# EasyEDA Pro project ProPrj_由机芯智能技术人员指导下的新合成板_20250317_2025-03-25.epro

# Schematic stm32桌面宠物
Board Name: stm32桌面宠物; Create Date: 2025-03-22; Page Name: P1; Project Name: 最新桌面宠物控制板-V1.2_20250317; Schematic Name: stm32桌面宠物; Update Date: 2025-03-22; Company: 嘉立创EDA; Page Size: A4; Version: V1.0
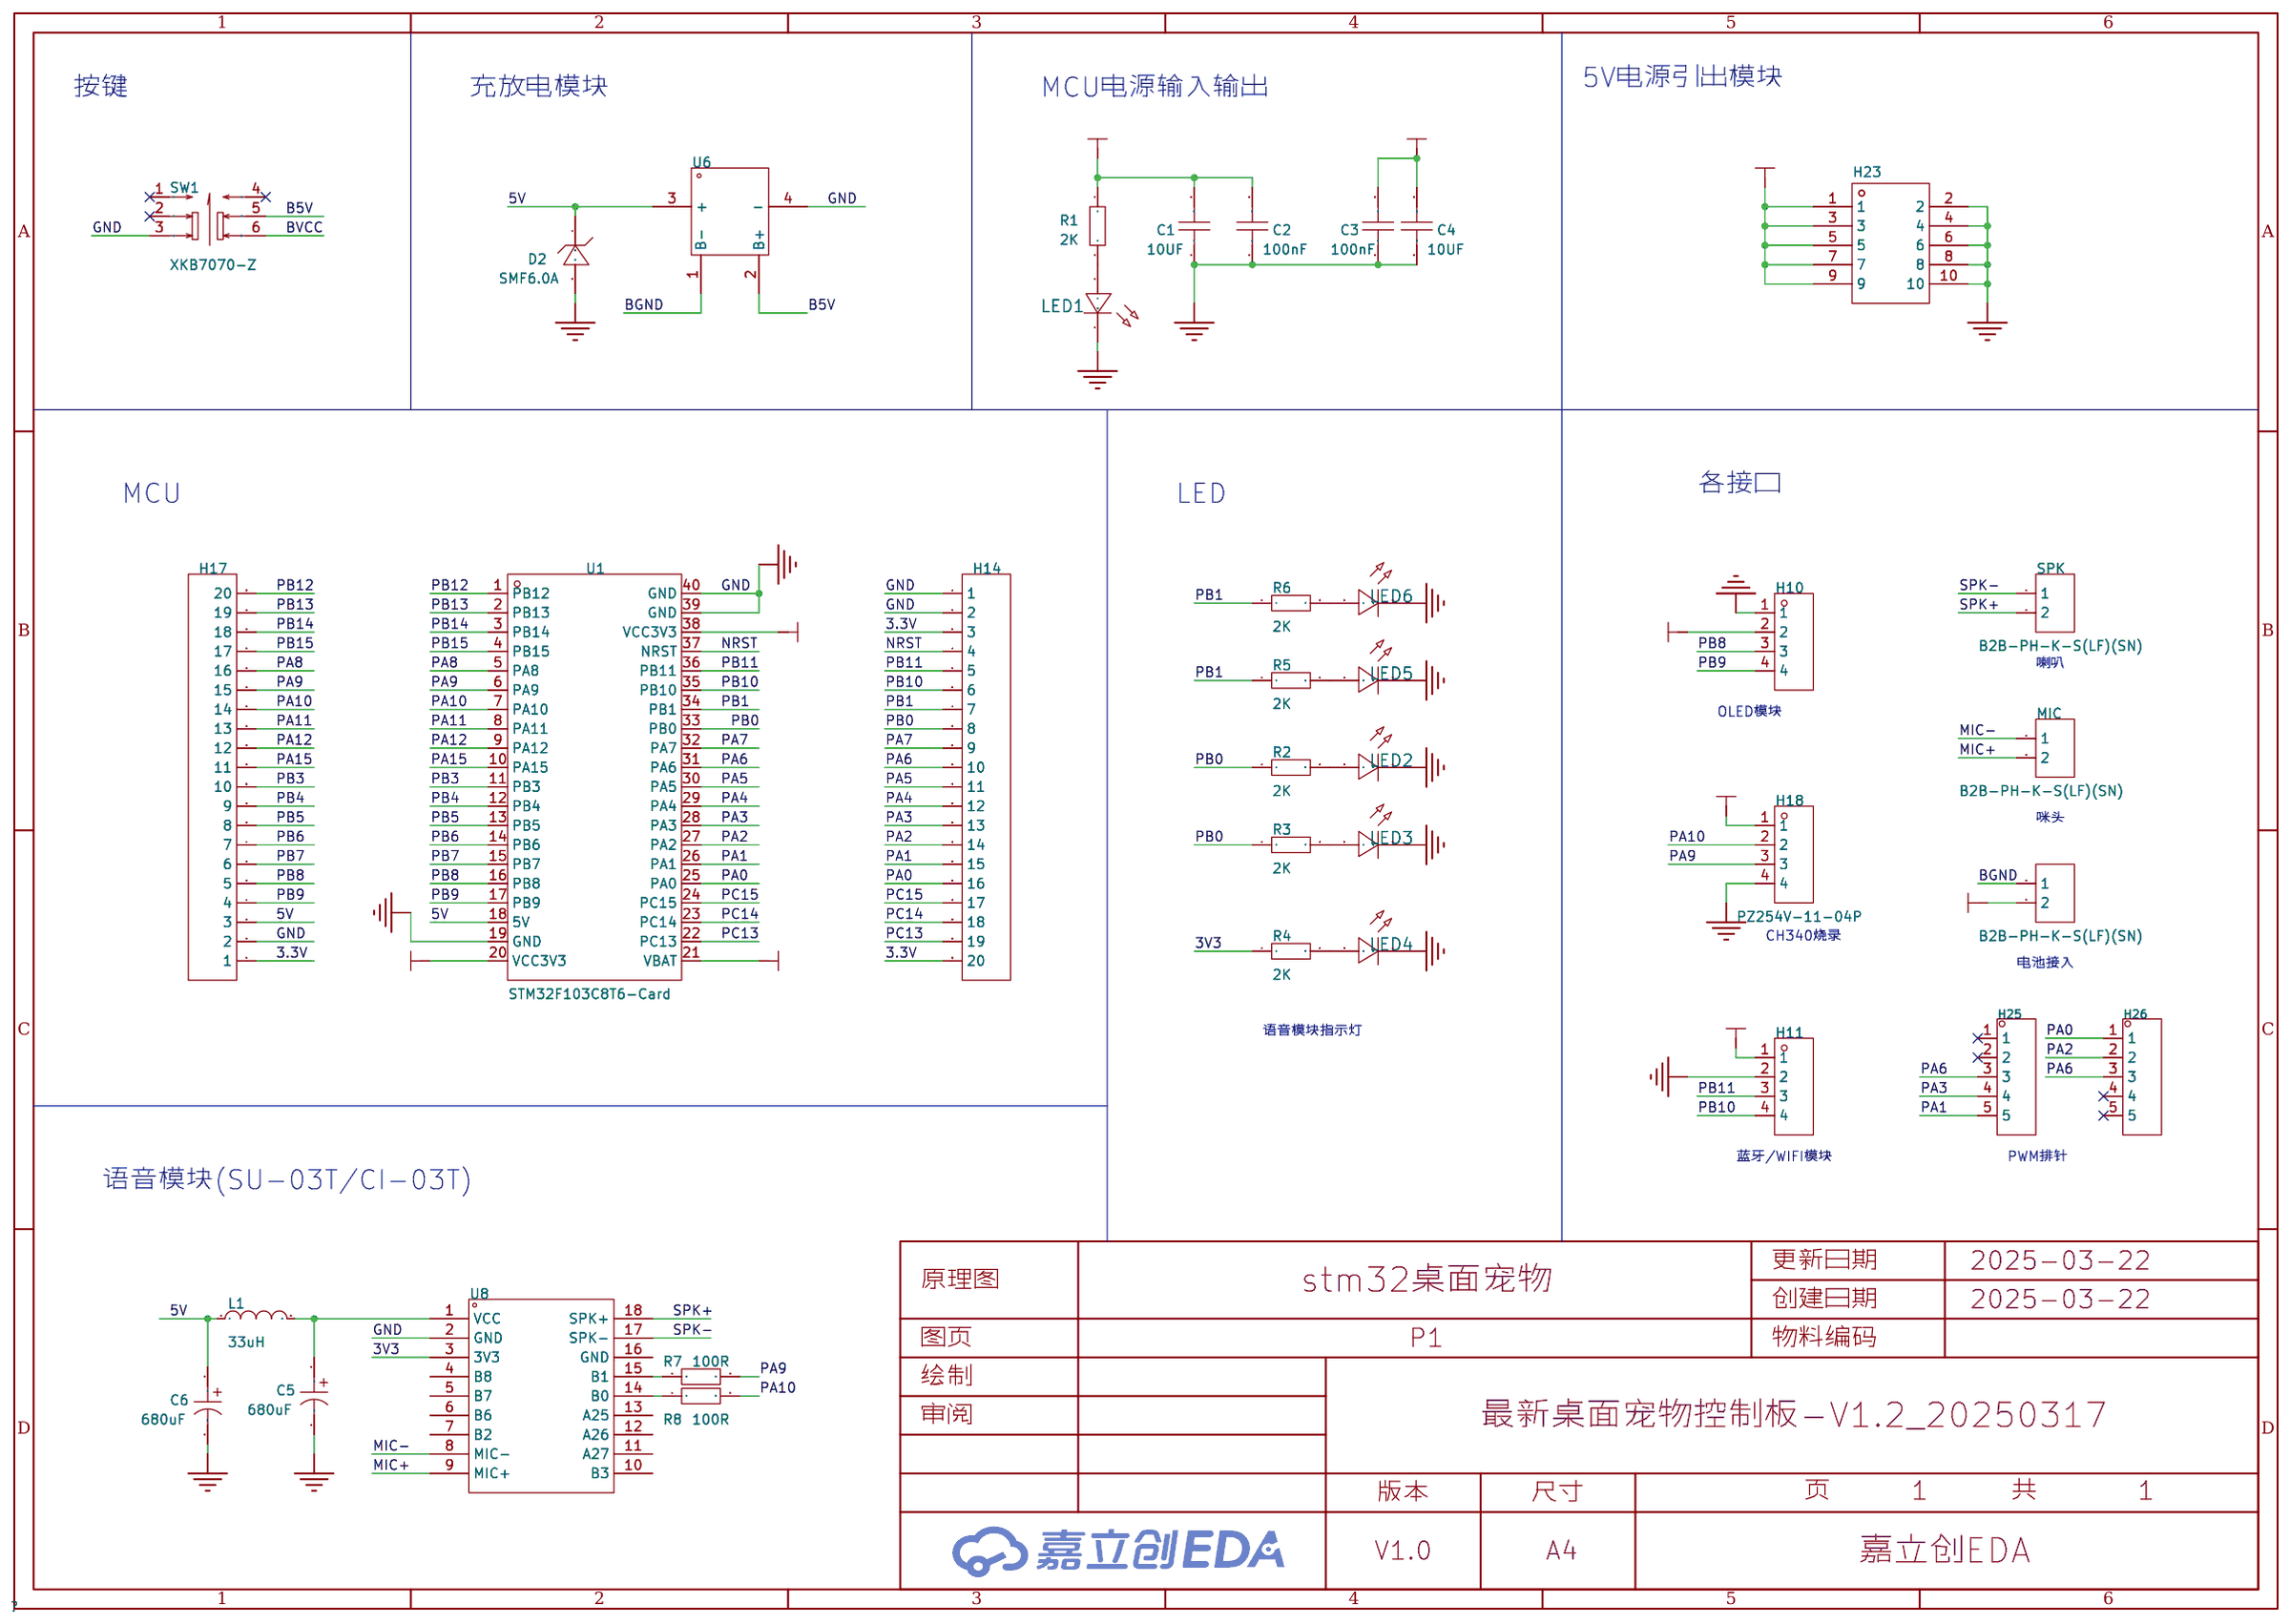
[diagram p0: schematic sheet]

## Parts
C1  10UF  [C0805]
C2  100nF  [C0805]
C3  100nF  [C0805]
C4  10UF  [C0805]
C5  680uF  [CAP-TH_BD8.0-P3.50-D0.6-FD_1]
C6  680uF  [CAP-TH_BD8.0-P3.50-D0.6-FD_1]
D2  SMF6.0A  [SOD-123FL_L2.8-W1.8-LS3.8-RD]
H10  -  [HDR-TH_4P-P2.54-V-F]
H11  -  [HDR-TH_4P-P2.54-V-F]
H14  -  [HDR-TH_20P-P2.54-V-F]
H17  -  [HDR-TH_20P-P2.54-V-F]
H18  PZ254V-11-04P  [HDR-TH_4P-P2.54-V-M]
H23  -  [HDR-TH_10P-P2.54-V-M-R2-C5-S2.54]
H25  -  [HDR-TH_5P-P2.54-V-M]
H26  -  [HDR-TH_5P-P2.54-V-M]
L1  33uH  [IND-TH_BD7.5-P3.00-D0.6]
LED1  -  [LED_0805]
LED2  -  [LED_0805]
LED3  -  [LED_0805]
LED4  -  [LED_0805]
LED5  -  [LED_0805]
LED6  -  [LED_0805]
MIC  B2B-PH-K-S(LF)(SN)  [CONN-TH_B2B-PH-K-S]
R1  2K  [R0805]
R2  2K  [R0805]
R3  2K  [R0805]
R4  2K  [R0805]
R5  2K  [R0805]
R6  2K  [R0805]
R7  100R  [R0805]
R8  100R  [R0805]
SPK  B2B-PH-K-S(LF)(SN)  [CONN-TH_B2B-PH-K-S]
SW1  XKB7070-Z  [SW-TH_6P-L7.0-W7.0-P2.00]
U1  STM32F103C8T6-Card  [CONN-TH_L53.3-W22.9_STM32F103C8T6-CARD]
U6  -  [充放电模块更新]
U8  -  [SU-03T带排针]
接锂电池  B2B-PH-K-S(LF)(SN)  [CONN-TH_B2B-PH-K-S]

## Library data of the parts
C1-C4 = CAP_0805: Supplier Footprint: 0805
C5 C6 = CD2884771EM0812VFL: 容值:470uF;额定电压:25V;; LCSC Part Name: 470uF 25V; Supplier Part: C2960233; Manufacturer: HRK(鸿瑞凯电子); Supplier Footprint: 插件,D8xL12mm; Datasheet: https://atta.szlcsc.com/upload/public/pdf/source/20240703/D49961C1CEC6E325964F7113D69E9087.pdf; Supplier: LCSC; Rated Voltage: 25V; φD: 8mm; L: 12mm; Operating Temperature: -40℃~+105℃
D2 = SMF6.0A: 极性:单向;反向截止电压(Vrwm):6V;钳位电压:10.3V;峰值脉冲电流(Ipp):19.4A;峰值脉冲功率(Ppp):200W;击穿电压:6.67V;; LCSC Part Name: 单向TVS 6V截止 19.4A峰值脉冲; Supplier Part: C2980406; Manufacturer: GOODWORK(固得沃克); Supplier Footprint: SOD-123FL; Datasheet: https://atta.szlcsc.com/upload/public/pdf/source/20240508/80D6E9463317C72355489DDC2072889A.pdf; Supplier: LCSC; Polarity: 单向; Reverse Stand-Off Voltage (Vrwm): 6V; Clamping Voltage: 10.3V; Peak Pulse Current (Ipp): 19.4A; Peak Pulse Power Dissipation (Ppp): 200W; Voltage - Breakdown: 6.67V; Reverse Leakage Current (Ir): 400uA; Number of Channels: 单路; Operating Temperature: -55℃~+150℃@(Tj); Type: TVS
H10 H11 = HDR-F_2.54_1x4P: Supplier Part: C2718488; Supplier Footprint: 插件
H14 H17 = HDR-F_2.54_1x20P: Supplier Part: C50984; Supplier Footprint: 插件
H18 = PZ254V-11-04P: 插针结构:1x4P;间距:2.54mm;行距:-;圆针/方针:方针;安装类型:直插;排数:单排;总PIN位数:4P;额定电流:3A;额定电压:250V;配合针长度:6mm;塑高:2.5mm;端接针长度:3mm;触头材质:-;工作温度范围:-40℃~+105℃;颜色:黑色;; LCSC Part Name: 间距:2.54mm 1x4P 直插 方针; Supplier Part: C2691448; Manufacturer: XFCN(兴飞); Supplier Footprint: 插件,P=2.54mm; JLCPCB Part Class: Extended Part; Datasheet: https://atta.szlcsc.com/upload/public/pdf/source/20200309/C492403_F9F19131791D08044AD4F84F8E751A34.pdf; Supplier: LCSC; Pin Structure: 1x4P; Pitch: 2.54mm; Circluar Pins/Square Pins: 方针; Mounting Type: 直插; Number of Rows: 单排; Number of Pins: 4P; Current Rating (Max): 3A; Voltage Rating (Max): 250V; Length of Mating Pin: 6mm; Insulation Height: 2.5mm; Length of End Connection Pin: 3mm; Operating Temperature Range: -40℃~+105℃; Color: 黑色
H23 = HDR-M_2.54_2x5: Supplier Part: C124387; Supplier Footprint: 插件,P=2.54mm
H25 H26 = HDR-M_2.54_1x5P: Supplier Part: C358687; Supplier Footprint: 插件
L1 = XR6*10-330K-S: 电感值:33uH;精度:±10%;饱和电流(Isat):1A;类型:磁环电感;; LCSC Part Name: 33uH ±10% 1A 磁环电感; Supplier Part: C22447637; Manufacturer: XR(祥如); Supplier Footprint: 插件,D7.5xL13mm; Datasheet: https://atta.szlcsc.com/upload/public/pdf/source/20240529/30D566BBC3D03FE80C0AAAF1CFF56DF1.pdf; Supplier: LCSC; Tolerance: ±10%; Current - Saturation (Isat): 1A; DC Resistance: 250mΩ; Type: 磁环电感; Wire Diameter: 0.3mm
LED1-LED6 = LED_0805-R: Supplier Footprint: 0805
MIC SPK 接锂电池 = B2B-PH-K-S(LF)(SN): 插针结构:1x2P;间距:2mm;安装方式:直插;参考系列:PH;总PIN数:2P;排数:1;每排PIN数:2;行距:-;额定电流:2A;触头材质:黄铜;触头镀层:锡;工作温度范围:-25℃~+85℃;; LCSC Part Name: 1x2P 间距:2mm 直插 系列:PH; Supplier Part: C131337; Manufacturer: JST; Supplier Footprint: 插件,P=2mm; JLCPCB Part Class: Extended Part; Datasheet: https://atta.szlcsc.com/upload/public/pdf/source/20171026/C131342_15089839687311058815.pdf; Supplier: LCSC; Pins Structure: 1x2P; Pitch: 2mm; Mounting Style: 直插; Reference Series: PH; Number of Pins: 2P; Number of Rows: 1; Number of PINs Per Row: 2; Current Rating (Max): 2A; Contact Material: 黄铜; Contact Plating: 锡; Operating Temperature Range: -25℃~+85℃; Rated Voltage (Max): 100V; Plastic Material: PA66; Flame Retardant Rating: UL94V-0; Supplementary Features: 打K脚; Colour: 白色; Z-Height of the Board: 6mm; X-Length of Bottom Edge on Board (Spacing Line): 5.9mm; Y-Width of Bottom Edge on Board: 4.5mm
R1-R8 = Res_0805: Supplier Footprint: 0805
SW1 = XKB7070-Z: 自锁/无锁:自锁;安装方式:直插;触点电流:100mA;额定电压 (AC):250V;额定电压 (DC):30V;带灯:不带;作用力:160gf;机械寿命:10万次;; LCSC Part Name: 按键开关   7*7插件自锁 蓝白黑; Supplier Part: C318863; Manufacturer: XKB Connectivity(中国星坤); Supplier Footprint: 插件; JLCPCB Part Class: 扩展库; Datasheet: https://atta.szlcsc.com/upload/public/pdf/source/20211015/75A682A27A424BDE8D93C2CFA14C38FE.pdf; Supplier: LCSC; Self Lock / No Lock: 自锁; Actuator Style: 矩形按钮; Mounting Style: 直插; Contact Current: 100mA; Voltage Rating (AC): 250V; Voltage Rating (DC): 30V; Insulation Resistance: 100MΩ; Actuator/Cap Color: 蓝色; With Lamp: 不带; Pin Style: PC引脚; Operating Force: 160gf; Operating Temperature: -15℃~+55℃; Mechanical Life: 10万次
U1 = STM32F103C8T6-Card: Supplier Part: C9900077949; Supplier Footprint: 插件; Supplier: LCSC
U6 = 5V充放电模块
U8 = SU-03T带排针

## Nets
3.3V: C3.2 C4.2 H10.2 H11.1 H14.3 H14.20 H17.1 U1.20(VCC3V3) U1.21(VBAT) U1.38(VCC3V3)
3V3: R4.1 U8.3(3V3)
5V: C1.2 C2.2 C6.1 D2.1(C) H17.3 H18.1 H23.1 H23.3 H23.5 H23.7 H23.9 L1.1 R1.1 U1.18(5V) U6.3(+)
GND: C1.1 C2.1 C3.1 C4.1 C5.2 C6.2 D2.2(A) H10.1 H11.2 H14.1 H14.2 H17.2 H18.4 H23.2 H23.4 H23.6 H23.8 H23.10 LED1.1(C) LED2.1(C) LED3.1(C) LED4.1(C) LED5.1(C) LED6.1(C) SW1.3 U1.19(GND) U1.39(GND) U1.40(GND) U6.4(-) U8.2(GND)
B5V: SW1.5 U6.2(B+)
BGND: U6.1(B-) 接锂电池.1
BVCC: SW1.6 接锂电池.2
MIC+: MIC.2 U8.9(MIC+)
MIC-: MIC.1 U8.8(MIC-)
NRST: H14.4 U1.37(NRST)
PA0: H14.16 H26.1 U1.25(PA0)
PA1: H14.15 H25.5 U1.26(PA1)
PA2: H14.14 H26.2 U1.27(PA2)
PA3: H14.13 H25.4 U1.28(PA3)
PA4: H14.12 U1.29(PA4)
PA5: H14.11 U1.30(PA5)
PA6: H14.10 H25.3 H26.3 U1.31(PA6)
PA7: H14.9 U1.32(PA7)
PA8: H17.16 U1.5(PA8)
PA9: H17.15 H18.3 R7.2 U1.6(PA9)
PA10: H17.14 H18.2 R8.2 U1.7(PA10)
PA11: H17.13 U1.8(PA11)
PA12: H17.12 U1.9(PA12)
PA15: H17.11 U1.10(PA15)
PB0: H14.8 R2.1 R3.1 U1.33(PB0)
PB1: H14.7 R5.1 R6.1 U1.34(PB1)
PB3: H17.10 U1.11(PB3)
PB4: H17.9 U1.12(PB4)
PB5: H17.8 U1.13(PB5)
PB6: H17.7 U1.14(PB6)
PB7: H17.6 U1.15(PB7)
PB8: H10.3 H17.5 U1.16(PB8)
PB9: H10.4 H17.4 U1.17(PB9)
PB10: H11.4 H14.6 U1.35(PB10)
PB11: H11.3 H14.5 U1.36(PB11)
PB12: H17.20 U1.1(PB12)
PB13: H17.19 U1.2(PB13)
PB14: H17.18 U1.3(PB14)
PB15: H17.17 U1.4(PB15)
PC13: H14.19 U1.22(PC13)
PC14: H14.18 U1.23(PC14)
PC15: H14.17 U1.24(PC15)
SPK+: SPK.2 U8.18(SPK+)
SPK-: SPK.1 U8.17(SPK-)
$1N1622: LED1.2(A) R1.2
$1N9704: LED2.2(A) R2.2
$1N12766: LED3.2(A) R3.2
$1N14398: LED4.2(A) R4.2
$1N16652: LED5.2(A) R5.2
$1N16720: LED6.2(A) R6.2
$1N20042: R7.1 U8.15(B1)
$1N20046: R8.1 U8.14(B0)
Net-(C5-1): C5.1 L1.2 U8.1(VCC)

Not connected (* = marked no-connect by the designer): H25 1* 2*; H26 4* 5*; SW1 1* 2* 4*; U8 4(B8) 5(B7) 6(B6) 7(B2) 10(B3) 11(A27) 12(A26) 13(A25) 16(GND)

## Notes on the sheet
- 5V电源引出模块
- 按键
- 充放电模块
- MCU电源输入输出
- 各接口
- MCU
- LED
- 喇叭
- OLED模块
- 咪头
- CH340烧录
- 电池接入
- 语音模块指示灯
- 蓝牙/WIFI模块
- PWM排针
- 语音模块(SU-03T/CI-03T)

# Board stm32桌面宠物
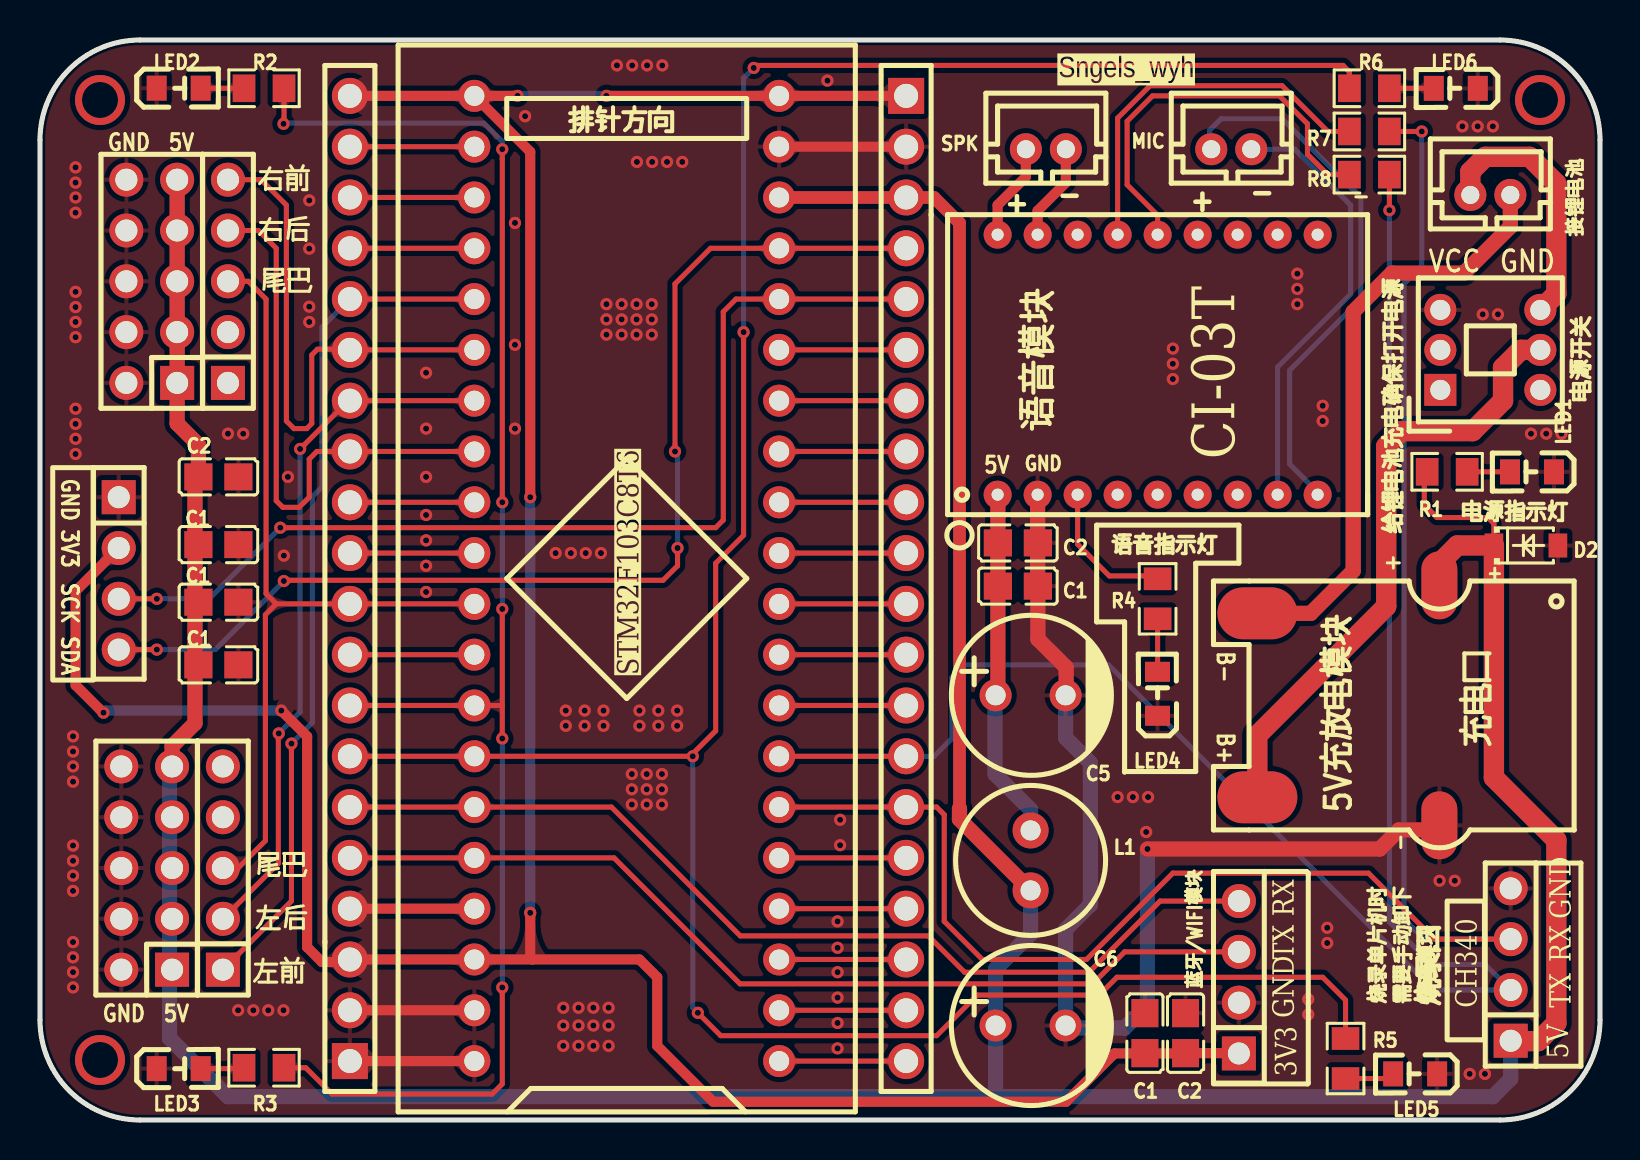
[diagram p1: board, top side]
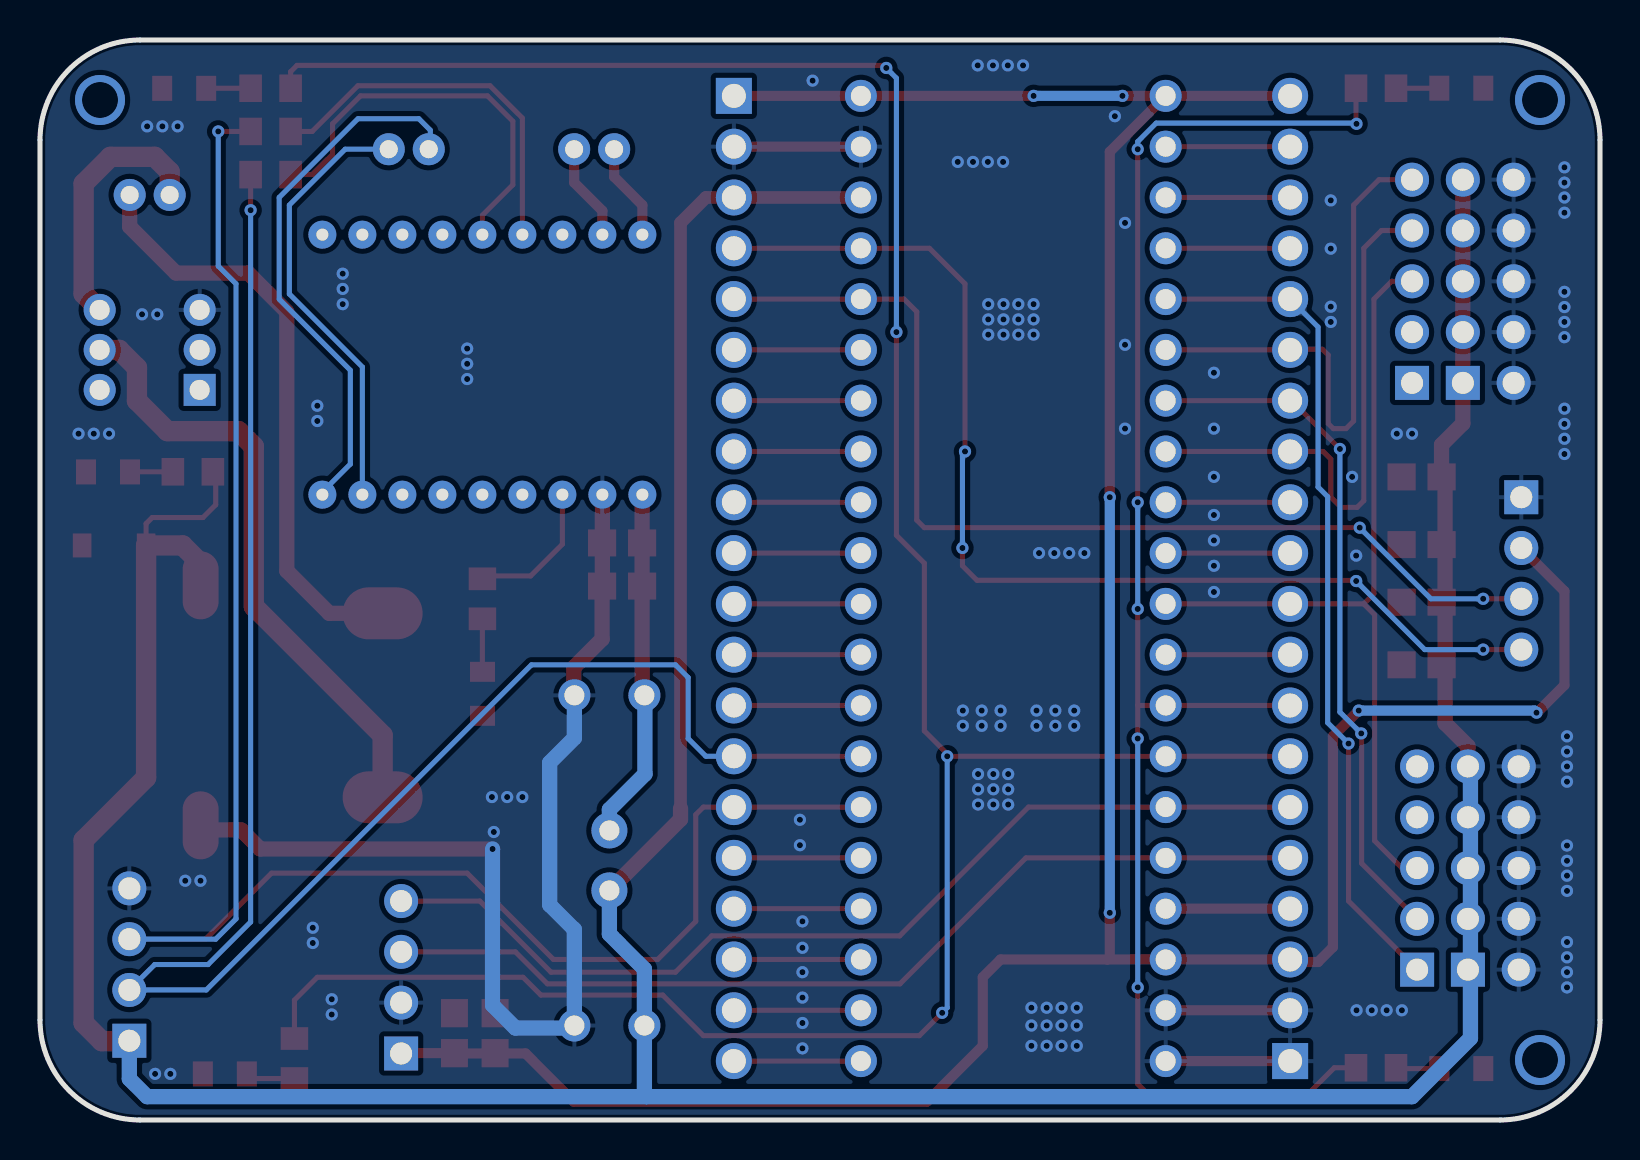
[diagram p2: board, bottom side, seen from below]

Outline 78 x 54 mm; copper layers: Top Layer, Bottom Layer. Coordinates in mm from the lower left corner of the outline.
Outline path: 0,49 0,5 arc(1.46,1.46) 5,0 73,0 arc(76.54,1.46) 78,5 78,49 arc(76.54,52.54) 73,54 5,54 arc(1.46,52.54) 0,49
Stack: Top Layer 0.035mm / Dielectric1 1.51mm FR4 er 4.5 / Bottom Layer 0.035mm

## Design rules (mm)
template: JLCPCB Capability(Two Layers Board)
spacing copperThickness1oz (default): track to track 0.102, other pairs 0.152 to 0.3
spacing copperThickness2oz: track to track 0.203, other pairs 0.152 to 0.3
track width copperThickness1oz (default): min 0.127, default 0.254, max 2.54
track width copperThickness2oz: min 0.203, default 0.254, max 2.54
differential pair differentialPair (default): width min 0.127, default 0.254, max 2.54; gap min 0.152, default 0.152
via viaSize (default): diameter min 0.5, default 0.61, max 10; hole min 0.3, default 0.305, max 6.3

## Placement (name value [footprint] x y rotation side)
C1  10UF  [C0805]  55.25 4.34 270 top
C1#2  -  [C0805]  48.9 26.69 180 top
C1#3  -  [C0805]  8.92 28.77 180 top
C1#4  -  [C0805]  8.92 22.76 180 top
C1#5  -  [C0805]  8.92 25.89 180 top
C2  100nF  [C0805]  57.28 4.34 270 top
C2#2  -  [C0805]  48.9 28.85 180 top
C2#3  -  [C0805]  8.92 32.16 180 top
C5  680uF  [CAP-TH_BD8.0-P3.50-D0.6-FD_1]  49.53 21.23 0 top
C6  680uF  [CAP-TH_BD8.0-P3.50-D0.6-FD_1]  49.53 4.72 0 top
D2  SMF6.0A  [SOD-123FL_L2.8-W1.8-LS3.8-RD]  74.29 28.73 0 top
H10  -  [HDR-TH_4P-P2.54-V-F]  3.94 27.33 270 top
H11  -  [HDR-TH_4P-P2.54-V-F]  59.94 7.14 90 top
H14  -  [HDR-TH_20P-P2.54-V-F]  15.49 27.08 90 top
H17  -  [HDR-TH_20P-P2.54-V-F]  43.31 27.08 270 top
H18  PZ254V-11-04P  [HDR-TH_4P-P2.54-V-M]  73.53 7.77 90 top
H23  -  [HDR-TH_10P-P2.54-V-M-R2-C5-S2.54]  5.59 41.94 90 top
H23#2  -  [HDR-TH_10P-P2.54-V-M-R2-C5-S2.54]  5.33 12.6 90 top
H25  -  [HDR-TH_5P-P2.54-V-M]  9.4 41.94 90 top
H26  -  [HDR-TH_5P-P2.54-V-M]  9.14 12.6 90 top
L1  33uH  [IND-TH_BD7.5-P3.00-D0.6]  49.53 12.98 90 top
LED1  -  [LED_0805]  74.55 32.41 180 top
LED2  -  [LED_0805]  6.98 51.59 0 top
LED3  -  [LED_0805]  6.98 2.56 0 top
LED4  -  [LED_0805]  55.88 21.36 90 top
LED5  -  [LED_0805]  68.71 2.31 180 top
LED6  -  [LED_0805]  70.74 51.59 180 top
MIC  B2B-PH-K-S(LF)(SN)  [CONN-TH_B2B-PH-K-S]  59.56 48.54 0 top
R1  2K  [R0805]  70.36 32.41 0 top
R2  2K  [R0805]  11.2 51.59 180 top
R3  2K  [R0805]  11.2 2.61 180 top
R4  2K  [R0805]  55.88 26.06 270 top
R5  2K  [R0805]  65.28 3.07 270 top
R6  2K  [R0805]  66.47 51.59 0 top
R7  100R  [R0805]  66.47 49.43 0 top
R8  100R  [R0805]  66.47 47.27 0 top
SPK  B2B-PH-K-S(LF)(SN)  [CONN-TH_B2B-PH-K-S]  50.29 48.54 0 top
SW1  XKB7070-Z  [SW-TH_6P-L7.0-W7.0-P2.00]  72.52 38.51 180 top
U1  STM32F103C8T6-Card  [CONN-TH_L53.3-W22.9_STM32F103C8T6-CARD]  29.34 27.08 90 top
U6  -  [充放电模块更新]  61.47 25.93 270 top
U8  -  [SU-03T带排针]  63.88 31.27 90 top
接锂电池  B2B-PH-K-S(LF)(SN)  [CONN-TH_B2B-PH-K-S]  72.52 46.25 0 top

## Footprints (pads in the part's own frame, mm; a bottom-side part is the same pattern mirrored in y, then rotated)
C0805
  rect 1.41x1.35 smd: 1(-1,0) 2(1,0)
CAP-TH_BD8.0-P3.50-D0.6-FD_1
  round 1.6 hole 1: 1(-1.75,0) 2(1.75,0)
CONN-TH_B2B-PH-K-S
  round 1.6 hole 0.9: 1(1,0) 2(-1,0)
CONN-TH_L53.3-W22.9_STM32F103C8T6-CARD
  round 1.6 hole 1: 1(-24.13,-7.62) 2(-21.59,-7.62) 3(-19.05,-7.62) 4(-16.51,-7.62) 5(-13.97,-7.62) 6(-11.43,-7.62) 7(-8.89,-7.62) 8(-6.35,-7.62) 9(-3.81,-7.62) 10(-1.27,-7.62) 11(1.27,-7.62) 12(3.81,-7.62) 13(6.35,-7.62) 14(8.89,-7.62) 15(11.43,-7.62) 16(13.97,-7.62) 17(16.51,-7.62) 18(19.05,-7.62) 19(21.59,-7.62) 20(24.13,-7.62) 21(24.13,7.62) 22(21.59,7.62) 23(19.05,7.62) 24(16.51,7.62) 25(13.97,7.62) 26(11.43,7.62) 27(8.89,7.62) 28(6.35,7.62) 29(3.81,7.62) 30(1.27,7.62) 31(-1.27,7.62) 32(-3.81,7.62) 33(-6.35,7.62) 34(-8.89,7.62) 35(-11.43,7.62) 36(-13.97,7.62) 37(-16.51,7.62) 38(-19.05,7.62) 39(-21.59,7.62) 40(-24.13,7.62)
HDR-TH_4P-P2.54-V-F
  rect 1.7x1.7 hole 1.1: 1(-3.81,0)
  round 1.7 hole 1.1: 2(-1.27,0) 3(1.27,0) 4(3.81,0)
HDR-TH_4P-P2.54-V-M
  rect 1.7x1.7 hole 1.1: 1(-3.81,0)
  round 1.7 hole 1.1: 2(-1.27,0) 3(1.27,0) 4(3.81,0)
HDR-TH_5P-P2.54-V-M
  rect 1.7x1.7 hole 1.1: 1(-5.08,0)
  round 1.7 hole 1.1: 2(-2.54,0) 3(0,0) 4(2.54,0) 5(5.08,0)
HDR-TH_10P-P2.54-V-M-R2-C5-S2.54
  rect 1.7x1.7 hole 1.1: 1(-5.08,-1.27)
  round 1.7 hole 1.1: 2(-5.08,1.27) 3(-2.54,-1.27) 4(-2.54,1.27) 5(0,-1.27) 6(0,1.27) 7(2.54,-1.27) 8(2.54,1.27) 9(5.08,-1.27) 10(5.08,1.27)
HDR-TH_20P-P2.54-V-F
  rect 1.8x1.8 hole 1.2: 1(-24.13,0)
  round 1.8 hole 1.2: 2(-21.59,0) 3(-19.05,0) 4(-16.51,0) 5(-13.97,0) 6(-11.43,0) 7(-8.89,0) 8(-6.35,0) 9(-3.81,0) 10(-1.27,0) 11(1.27,0) 12(3.81,0) 13(6.35,0) 14(8.89,0) 15(11.43,0) 16(13.97,0) 17(16.51,0) 18(19.05,0) 19(21.59,0) 20(24.13,0)
IND-TH_BD7.5-P3.00-D0.6
  round 1.8 hole 1: 1(-1.5,0) 2(1.5,0)
LED_0805
  rect 1x1.25 smd: 1(-1.15,0.005) 2(1.05,0.005)
R0805
  rect 1.133x1.377 smd: 1(-1,0) 2(1,0)
SOD-123FL_L2.8-W1.8-LS3.8-RD
  rect 0.93x1.2 smd: 1(-1.6,0) 2(1.6,0)
SU-03T带排针
  round 1.4 hole 0.6: 1(0,16) 2(0,14) 3(0,12) 4(0,10) 5(0,8) 6(0,6) 7(0,4) 8(0,2) 9(0,0) 10(13,0) 11(13,2) 12(13,4) 13(13,6) 14(13,8) 15(13,10) 16(13,12) 17(13,14) 18(13,16)
SW-TH_6P-L7.0-W7.0-P2.00
  rect 1.6x1.6 hole 1: 1(2.499,2)
  round 1.6 hole 1: 2(2.5,0) 3(2.5,-2) 4(-2.5,2) 5(-2.5,0) 6(-2.5,-2)
充放电模块更新
  oval 2.6x4 smd: 1(0.6,-0.6) 2(9.8,-0.6)
  oval 3.4x1.8 smd: 3(-0.8,8.5) 4(11.2,8.5)

## Nets
As in the schematic, except:
3.3V: C1.2 C2.2 H10.2 H11.1 H14.3 H14.20 H17.1 U1.20 U1.21 U1.38
5V: C1#3.2 C1#4.2 C1#5.2 C2#3.2 C6.1 D2.1 H17.3 H18.1 H23.1 H23.3 H23.5 H23.7 H23.9 H23#2.1 H23#2.3 H23#2.5 H23#2.7 H23#2.9 L1.1 R1.1 U1.18 U6.3
GND: C1.1 C1#2.1 C1#3.1 C1#4.1 C1#5.1 C2.1 C2#2.1 C2#3.1 C5.2 C6.2 D2.2 H10.1 H11.2 H14.1 H14.2 H17.2 H18.4 H23.2 H23.4 H23.6 H23.8 H23.10 H23#2.2 H23#2.4 H23#2.6 H23#2.8 H23#2.10 LED1.1 LED2.1 LED3.1 LED4.1 LED5.1 LED6.1 SW1.3 U1.19 U1.39 U1.40 U6.4 U8.2
$1N12679: C1#2.2 C2#2.2 C5.1 L1.2 U8.1

Pads without a net: H25 1 2; H26 4 5; SW1 1 2 4; U8 4 5 6 7 10 11 12 13 16

## Via types
v1: diameter 2.5, hole 1.8, Top Layer to Bottom Layer, 3 vias
v2: diameter 0.61, hole 0.305, Top Layer to Bottom Layer, 169 vias

## Routing (per net, layer and track width the routed paths; a pad name or vN(x,y) marks a point on that pad's centre or on a via; arc(x,y) is an arc through that point)
3.3V: length 156.1
  Top Layer w0.508: H17.1 U1.20 v2(28.32,51.21) ; v2(24.51,31.14) 24.51,48.41 U1.21 ; U1.21 H14.20 ; U1.21 v2(23.88,51.21) ; H10.2 1.78,26.44 1.78,21.74 3.15,20.37 v2(3.17,20.37) ; v2(24.51,10.36) 24.51,8.15 24.64,8.03 ; 24.64,8.03 U1.38 H14.3 15.37,7.9 14.1,7.9 13.36,8.64 13.36,19.18 v2(12.06,20.47) ; 24.64,8.03 29.97,8.03 30.86,7.14 30.86,3.71 33.66,0.91 51.31,0.91 53.72,3.33 57.26,3.33 C2.2 59.93,3.34 H11.1
  Bottom Layer w0.508: v2(23.88,51.21) v2(28.32,51.21) ; v2(24.51,10.36) v2(24.51,31.14) ; v2(3.17,20.37) 3.28,20.47 v2(12.06,20.47)
3V3: length 7.2
  Top Layer w0.254: R4.1 55.74,27.2 53.47,27.2 51.88,28.79 U8.3
5V: length 208.7
  Top Layer w0.254: D2.1 72.69,29.82 72.39,30.12 69.85,30.12 69.22,30.76 69.22,32.27 R1.1
  Top Layer w0.635: 45.97,15.58 45.97,44.86 44.7,46.13 H17.3 U1.18
  Top Layer w0.762: H23.9 H23.7 H23.5 H23.3 H23.1 6.86,34.82 7.92,33.76 C2#3.2 7.75,31.98 7.75,19.84 6.6,18.69 H23#2.9 ; 45.97,15.58 45.97,15.03 L1.1
  Top Layer w1.016: U6.3 69.97,27.83 70.87,28.73 D2.1 72.69,17.12 75.82,14 75.82,4.85 74.91,3.94 74.15,3.94 74.13,3.96 H18.1
  Bottom Layer w0.762: 47.68,1.17 47.78,1.26 C6.1 47.78,7.55 49.53,9.3 L1.1 ; 47.68,1.17 72.64,1.17 73.53,2.06 H18.1 ; 47.68,1.17 9.4,1.17 6.48,4.09 6.48,17.55 H23#2.9
GND: length 74.5
  Top Layer w0.508: H14.1 U1.40 ; U1.19 H17.2 ; H14.2 U1.39
  Top Layer w0.762: v2(55.37,13.55) 66.99,13.55 67.94,14.5 69.74,14.5 U6.4 ; C5.2 51.31,21.26 51.31,22.63 49.9,24.04 C1#2.1 49.88,26.71 U8.2
  Bottom Layer w0.762: C5.2 51.28,19.1 52.52,17.86 52.52,10.76 51.28,9.52 C6.2 51.41,4.6 54.23,4.6 55.37,5.74 v2(55.37,13.55)
  vias: v2(1.65,19.18) v2(1.65,18.42) v2(1.65,17.68) v2(1.65,16.92) v2(1.65,13.72) v2(1.65,12.96) v2(1.65,12.22) v2(1.65,11.45) v2(1.65,8.9) v2(1.65,8.13) v2(1.65,7.39) v2(1.65,6.63) v2(1.78,47.63) v2(1.78,46.87) v2(1.78,46.13) v2(1.78,45.36) v2(1.78,41.41) v2(1.78,40.65) v2(1.78,39.9) v2(1.78,39.14) v2(1.78,35.57) v2(1.78,34.8) v2(1.78,34.06) v2(1.78,33.3) v2(9.4,34.31) v2(9.91,5.49) v2(10.16,34.31) v2(10.67,5.49) v2(11.41,5.49) v2(12.19,28.22) v2(12.17,5.49) v2(12.39,32.16) v2(13.46,45.98) v2(13.46,43.57) v2(13.46,40.67) v2(13.46,39.9) v2(19.3,37.36) v2(19.3,34.57) v2(19.3,32.16) v2(19.3,30.25) v2(19.3,28.98) v2(19.3,27.71) v2(19.3,26.4) v2(23.75,44.86) v2(23.75,38.76) v2(23.75,34.57) v2(24.26,50.19) v2(25.78,28.35) v2(26.16,5.61) v2(26.16,4.72) v2(26.16,3.71) v2(26.29,20.47) v2(26.29,19.71) v2(26.54,28.35) v2(26.92,5.61) v2(26.92,4.72) v2(26.92,3.71) v2(27.23,20.47) v2(27.23,19.71) v2(27.29,28.35) v2(27.67,5.61) v2(27.67,4.72) v2(27.67,3.71) v2(28.05,28.35) v2(28.18,20.47) v2(28.18,19.71) v2(28.32,40.79) v2(28.32,40.03) v2(28.32,39.27) v2(28.43,5.61) v2(28.43,4.72) v2(28.43,3.71) v2(28.85,52.73) v2(29.08,40.79) v2(29.08,40.03) v2(29.08,39.27) v2(29.61,52.73) v2(29.59,17.3) v2(29.59,16.53) v2(29.59,15.77) v2(29.84,47.9) v2(29.83,40.79) v2(29.83,40.03) v2(29.83,39.27) v2(29.97,20.47) v2(29.97,19.71) v2(30.33,17.3) v2(30.33,16.53) v2(30.33,15.77) v2(30.35,52.73) v2(30.61,47.9) v2(30.59,40.79) v2(30.59,40.03) v2(30.59,39.27) v2(30.92,20.47) v2(30.92,19.71) v2(31.12,52.73) v2(31.1,17.3) v2(31.1,16.53) v2(31.1,15.77) v2(31.35,47.9) v2(31.86,20.47) v2(31.86,19.71) v2(32.11,47.9) v2(39.37,51.97) v2(39.88,9.93) v2(39.88,8.61) v2(39.88,7.39) v2(39.88,6.12) v2(39.88,4.85) v2(39.88,3.58) v2(40,15.01) v2(40,13.74) v2(53.88,16.15) v2(54.64,16.15) v2(55.31,14.4) v2(55.41,16.15) v2(56.64,38.57) v2(56.64,37.81) v2(56.64,37.05) v2(62.87,42.32) v2(62.87,41.55) v2(62.87,40.79) v2(63.41,6.04) v2(63.41,5.28) v2(64.13,35.71) v2(64.13,34.95) v2(64.36,9.61) v2(64.36,8.85) v2(69.98,11.96) v2(70.74,11.96) v2(71.12,49.68) v2(71.48,2.31) v2(71.88,49.68) v2(72.14,40.28) v2(72.25,2.31) v2(72.64,49.68) v2(72.9,40.28) v2(74.55,34.31) v2(75.31,34.31) v2(76.07,34.31)
(no net):
  vias: v1(3,51) v1(3,3) v1(75,51)
B5V: length 30.9
  Top Layer w1.016: 60.87,16.13 60.87,19.24 67.31,25.68 67.31,33.68 68.07,34.44 71.63,34.44 73.15,35.97 73.15,37.62 74.04,38.51 SW1.5
BGND: length 29.8
  Top Layer w0.762: 接锂电池.1 73.52,44.67 71.2,42.35 67.59,42.35 65.66,40.41 65.66,27.46 63.53,25.33 60.87,25.33
BVCC: length 13
  Top Layer w1.016: 接锂电池.2 71.52,47.41 72.26,48.16 74.48,48.16 75.82,46.82 75.82,41.31 SW1.6
MIC+: length 27.3
  Bottom Layer w0.254: U8.9 63.88,31.39 62.48,32.79 62.48,37.49 66.04,41.05 66.04,46.13 62.1,50.06 59.06,50.06 58.48,49.49 58.48,48.62 MIC.2
MIC-: length 22.1
  Bottom Layer w0.254: MIC.1 62.74,48.54 65.53,45.75 65.53,41.3 61.88,37.65 U8.8
NRST: length 6.2
  Top Layer w0.508: H14.4 U1.37
PA0: length 42.4
  Top Layer w0.254: U1.25 H14.16 ; H26.1 12.57,10.95 v2(12.57,18.82)
  Bottom Layer w0.254: H14.16 14.1,39.65 14.1,31.65 13.61,31.17 13.61,19.86 v2(12.57,18.82)
PA1: length 27.5
  Top Layer w0.254: U1.26 H14.15 15.37,38.51 15.33,38.54 13.88,38.54 13.59,38.25 13.59,34.82 13.33,34.57 12.7,34.57 12.32,34.95 12.32,45.75 11.05,47.02 H25.5
PA2: length 34.8
  Top Layer w0.254: v2(13,33.55) 15.42,35.97 H14.14 U1.27 ; v2(11.94,19.33) 11.92,19.31 11.92,12.83 H26.2
  Bottom Layer w0.254: v2(11.94,19.33) 13,20.4 v2(13,33.55)
PA3: length 27.7
  Top Layer w0.254: H25.4 10.92,44.47 11.81,43.59 11.81,30.97 12.14,30.63 12.95,30.63 13.46,31.14 13.46,33.05 13.84,33.43 H14.13 U1.28
PA4: length 6.2
  Top Layer w0.254: U1.29 H14.12
PA5: length 6.2
  Top Layer w0.254: U1.30 H14.11
PA6: length 42.4
  Top Layer w0.254: U1.31 H14.10 11.81,25.81 ; H26.3 9.91,12.6 11.27,13.96 11.27,25.26 11.81,25.81 ; 11.81,25.81 11.3,26.31 11.3,41.05 10.41,41.94 H25.3
PA7: length 6.2
  Top Layer w0.254: U1.32 H14.9
PA8: length 6.3
  Top Layer w0.254: U1.5 H17.16
PA9: length 93.1
  Top Layer w0.254: U1.6 H17.15 44.83,15.65 45.21,15.27 45.21,9.93 47.12,8.03 52.32,8.03 56.64,12.34 66.42,12.34 69.72,9.04 H18.3 ; R7.2 v2(69.09,49.43)
  Bottom Layer w0.254: H18.3 69.22,9.04 68.2,10.06 68.2,41.81 69.09,42.7 v2(69.09,49.43)
PA10: length 91.8
  Top Layer w0.254: U1.7 H17.14 ; R8.2 v2(67.47,45.49)
  Bottom Layer w0.254: H17.14 44.7,18.19 45.59,19.08 45.59,22.12 46.23,22.76 53.43,22.76 69.69,6.5 H18.2 72.26,7.77 69.6,7.77 67.47,9.9 v2(67.47,45.49)
PA11: length 6.3
  Top Layer w0.254: U1.8 H17.13
PA12: length 6.3
  Top Layer w0.254: U1.9 H17.12
PA15: length 6.3
  Top Layer w0.254: U1.10 H17.11
PB0: length 79.5
  Top Layer w0.254: v2(23.11,25.55) 23.11,20.73 ; 23.11,20.73 v2(23.11,19.08) ; 23.11,20.73 U1.33 H14.8 ; v2(12.18,49.81) 12.2,49.83 R2.1 ; v2(23.11,6.63) 23.11,1.8 22.61,1.29 14.61,1.29 13.29,2.61 R3.1 ; v2(23.11,48.54) 23.11,48.03 23.12,48.03 23.12,30.89 v2(23.11,30.89)
  Bottom Layer w0.254: v2(23.11,48.54) 23.11,48.92 22.19,49.84 12.21,49.84 v2(12.18,49.81) ; v2(23.11,6.63) v2(23.11,19.08) ; v2(23.11,30.89) v2(23.11,25.55)
PB1: length 133.1
  Top Layer w0.254: v2(32.89,5.36) 34.04,4.22 44.83,4.22 46.86,6.25 52.96,6.25 53.85,7.14 64.13,7.14 65.28,5.99 R5.1 ; 32.51,18.19 U1.34 H14.7 ; 32.51,18.19 33.78,19.46 33.78,27.84 35.18,29.23 v2(35.18,39.39) ; 32.51,18.19 v2(32.64,18.19) ; R6.1 65.47,52.41 65.15,52.73 35.81,52.73 v2(35.69,52.6)
  Bottom Layer w0.254: v2(35.69,52.6) 35.18,52.09 v2(35.18,39.39) ; v2(32.64,18.19) 32.64,5.61 v2(32.89,5.36)
PB3: length 6.3
  Top Layer w0.254: U1.11 H17.10
PB4: length 6.3
  Top Layer w0.254: U1.12 H17.9
PB5: length 6.3
  Top Layer w0.254: U1.13 H17.8
PB6: length 6.3
  Top Layer w0.254: U1.14 H17.7
PB7: length 6.3
  Top Layer w0.254: U1.15 H17.6
PB8: length 51.7
  Top Layer w0.254: H10.3 v2(5.84,26.06) ; H17.5 U1.16 34.8,41.05 34.16,40.41 34.16,30 33.78,29.62 v2(12.01,29.62)
  Bottom Layer w0.254: v2(5.84,26.06) 8.46,26.06 v2(12.01,29.62)
PB9: length 56.1
  Top Layer w0.254: H10.4 v2(5.84,23.52) ; v2(31.88,28.6) 31.88,27.71 31.15,26.98 12.23,26.98 v2(12.19,26.95) ; v2(31.75,33.43) 31.75,41.81 33.53,43.59 U1.17 H17.4
  Bottom Layer w0.254: v2(31.88,28.6) 31.88,33.3 v2(31.75,33.43) ; v2(5.84,23.52) 8.76,23.52 v2(12.19,26.95)
PB10: length 49.3
  Top Layer w0.254: H11.4 56.01,10.95 52.45,7.39 46.23,7.39 44.41,9.2 35.02,9.2 28.57,15.65 U1.35 H14.6
PB11: length 47.7
  Top Layer w0.254: H11.3 54.23,8.41 52.63,6.81 35,6.81 28.7,13.11 U1.36 H14.5
PB12: length 6.3
  Top Layer w0.254: U1.1 H17.20
PB13: length 6.3
  Top Layer w0.254: U1.2 H17.19
PB14: length 6.3
  Top Layer w0.254: U1.3 H17.18
PB15: length 6.3
  Top Layer w0.254: U1.4 H17.17
PC13: length 6.2
  Top Layer w0.254: U1.22 H14.19
PC14: length 6.2
  Top Layer w0.254: U1.23 H14.18
PC15: length 6.2
  Top Layer w0.254: U1.24 H14.17
SPK+: length 4.5
  Top Layer w0.508: U8.18 47.88,45.75 49.29,47.16 49.29,48.16
SPK-: length 4.5
  Top Layer w0.508: U8.17 49.88,45.46 51.29,46.87 51.29,48.16
$1N1622: length 2.1
  Top Layer w0.254: R1.2 73.49,32.41 LED1.2
$1N9704: length 2.2
  Top Layer w0.254: R2.2 8.04,51.59 LED2.2
$1N12679: length 17.6
  Top Layer w0.762: C5.1 47.9,21.35 C1#2.2 C2#2.2 47.9,31.25 U8.1
  Bottom Layer w0.762: C5.1 47.75,21.21 47.75,17.3 49.53,15.52 L1.2
$1N12766: length 2.5
  Top Layer w0.254: LED3.2 9.9,2.57 10.16,2.82 10.16,2.66 R3.2
$1N14398: length 2.7
  Top Layer w0.254: LED4.2 55.88,22.42 R4.2
$1N16652: length 2.5
  Top Layer w0.254: R5.2 67.42,2.07 LED5.2
$1N16720: length 2.2
  Top Layer w0.254: LED6.2 69.68,51.59 R6.2
$1N20042: length 19
  Top Layer w0.254: U8.15 53.88,50.1 55.5,51.71 62.1,51.71 64.39,49.43 R7.1
$1N20046: length 20.5
  Top Layer w0.254: U8.14 55.88,45.24 54.36,46.76 54.36,49.94 55.63,51.21 61.98,51.21 63.37,49.81 63.37,48.28 64.39,47.27 R8.1

## Copper pours and planes (outline as drawn; the poured copper is in the pictures)
GND on Top Layer: 0,54.13 77.98,54.13 77.98,-0.1 0,-0.1
GND on Top Layer: 54.48,14.89 56.13,14.89 56.13,12.73 54.48,12.73
GND on Bottom Layer: 54.48,14.88 56.13,14.88 56.13,12.72 54.48,12.72
GND on Bottom Layer: 0,53.95 77.98,53.95 77.98,-0.1 0,-0.1

Small or netless copper shapes (teardrops, artwork), in the pictures only: 128 on Top Layer, 23 on Bottom Layer

## Text on the board
Top Silkscreen Layer: GND | + | - | 3V3 | SCK | SDA | B- | 5V | B+ | VCC | Sngels_wyh | 左前 | 尾巴 | 左后 | 右前 | 右后 | 排针方向 | STM32F103C8T6 | RX | TX | CH340 | 烧录单片机时 / 需要手动卸下 / 语音模块 | 蓝牙/WIFI模块 | 电源指示灯 | 电源开关 | 语音指示灯 | 给锂电池充电确保打开电源 | 烧录口 | 5V充放电模块 | 充电口 | 语音模块 | CI-03T
